# Altium schematic sheet Sheet1.SchDoc
size Letter
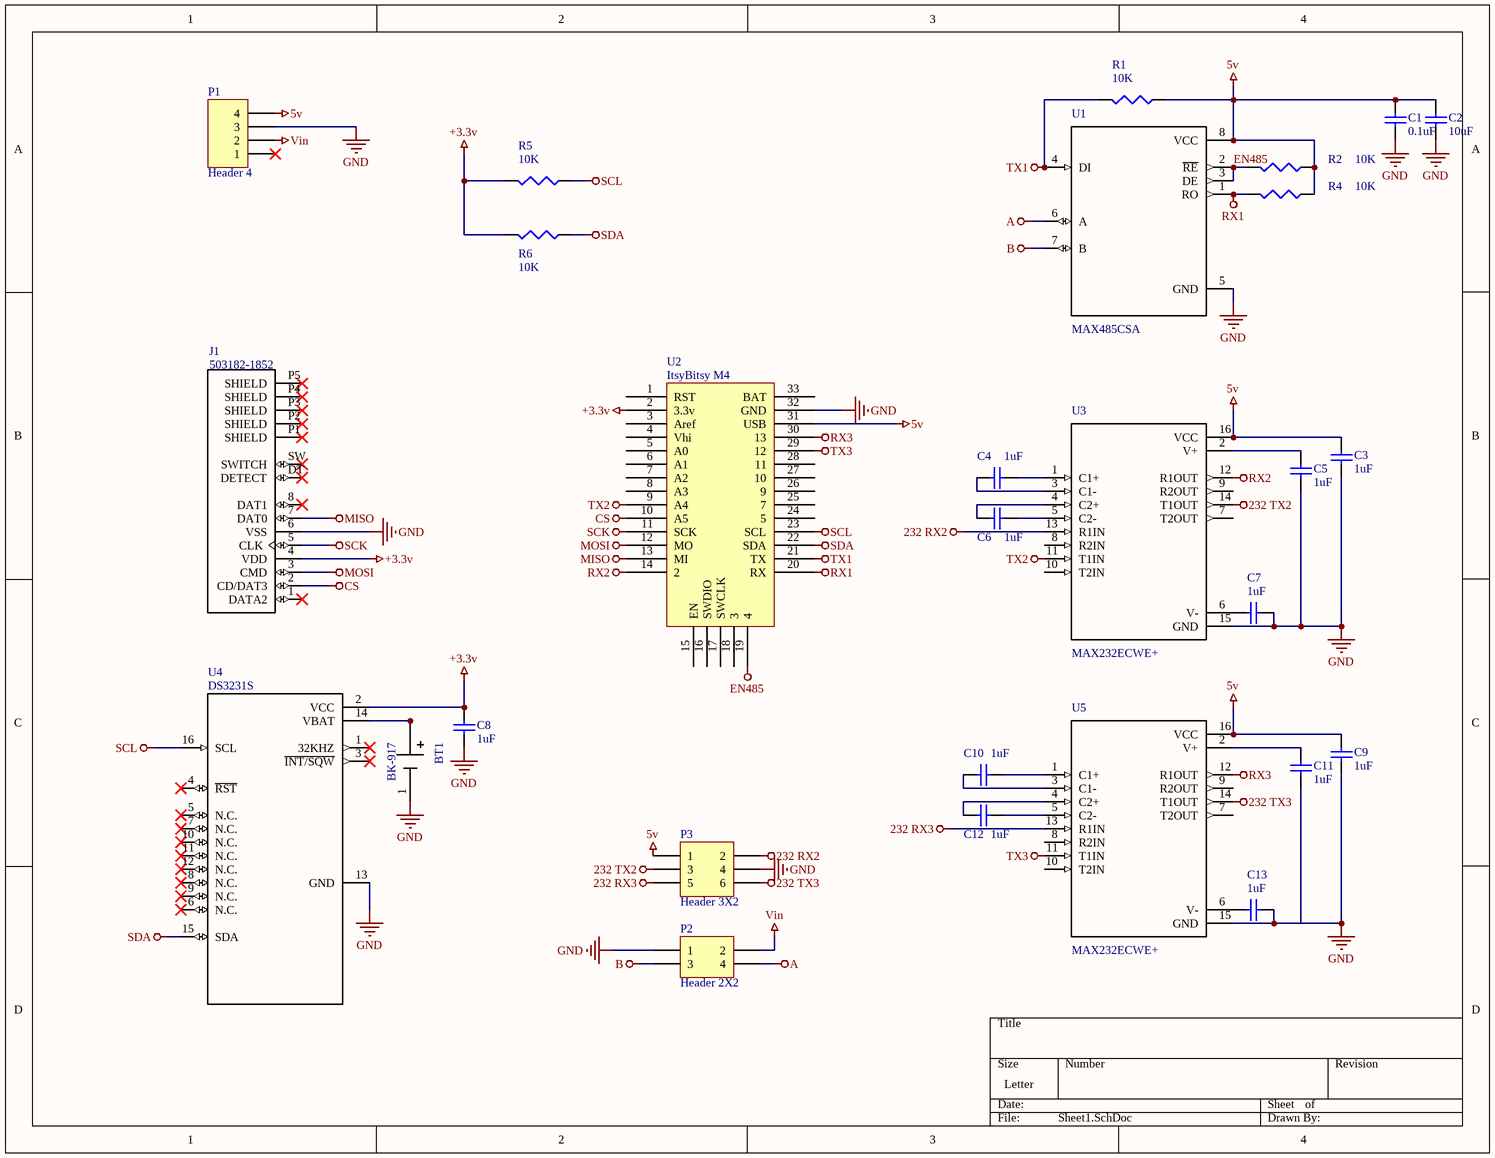
[diagram p0: Sheet1.SchDoc]

## Parts
BT1  BK-917  [*BAT_BK-917_BK-917(Primary)]
C1  value 0.1uF  [1608[0603]]  (hidden comment: Cap Semi)
C2  value 10uF  [1608[0603]]  (hidden comment: Cap Semi)
C3  value 1uF  [1608[0603]]  (hidden comment: Cap Semi)
C4  value 1uF  [1608[0603]]  (hidden comment: Cap Semi)
C5  value 1uF  [1608[0603]]  (hidden comment: Cap Semi)
C6  value 1uF  [1608[0603]]  (hidden comment: Cap Semi)
C7  value 1uF  [1608[0603]]  (hidden comment: Cap Semi)
C8  value 1uF  [1608[0603]]  (hidden comment: Cap Semi)
C9  value 1uF  [1608[0603]]  (hidden comment: Cap Semi)
C10  value 1uF  [1608[0603]]  (hidden comment: Cap Semi)
C11  value 1uF  [1608[0603]]  (hidden comment: Cap Semi)
C12  value 1uF  [1608[0603]]  (hidden comment: Cap Semi)
C13  value 1uF  [1608[0603]]  (hidden comment: Cap Semi)
J1  503182-1852  [*MOLEX_503182-1852_503182-1852(Primary)]
P1  Header 4  [HDR1X4]
P2  Header 2X2  [2x2 MOLEX]
P3  Header 3X2  [2x3 MOLEX]
R1  value 10K  [J1-0603]  (hidden comment: Res3)
R2  value 10K  [J1-0603]  (hidden comment: Res3)
R4  value 10K  [J1-0603]  (hidden comment: Res3)
R5  value 10K  [J1-0603]  (hidden comment: Res3)
R6  value 10K  [J1-0603]  (hidden comment: Res3)
U1  MAX485CSA  [*SOIC127P600X175-8N]
U2  ItsyBitsy M4  [ItsyBitsy M4]
U3  MAX232ECWE+  [*SOIC127P1032X265-16N]
U4  DS3231S  [*SOIC127P1032X265-16N]
U5  MAX232ECWE+  [*SOIC127P1032X265-16N]

## Nets
5v: C1.2 C2.2 C3.2 C9.2 P1.4 P3.1 R1.1 R2.1 R4.1 U1.8(VCC) U2.31(USB) U3.16(VCC) U5.16(VCC)
232 RX2: P3.2 U3.13(R1IN)
232 RX3: P3.5 U5.13(R1IN)
232 TX2: P3.3 U3.14(T1OUT)
232 TX3: P3.6 U5.14(T1OUT)
+3.3v: C8.2 J1.4(VDD) R5.2 R6.2 U2.2(3.3v) U4.2(VCC)
A: P2.4 U1.6(A)
B: P2.3 U1.7(B)
CS: J1.2(CD/DAT3) U2.10(A5)
EN485: R2.2 U1.2(~{RE}) U1.3(DE) U2.19(4)
GND: BT1.1(NEG) C1.1 C2.1 C3.1 C5.1 C7.1 C8.1 C9.1 C11.1 C13.1 J1.6(VSS) P1.3 P2.1 P3.4 U1.5(GND) U2.32(GND) U3.15(GND) U4.13(GND) U5.15(GND)
MISO: J1.7(DAT0) U2.13(MI)
MOSI: J1.3(CMD) U2.12(MO)
RX1: R4.2 U1.1(RO) U2.20(RX)
RX2: U2.14(2) U3.12(R1OUT)
RX3: U2.30(13) U5.12(R1OUT)
SCK: J1.5(CLK) U2.11(SCK)
SCL: R5.1 U2.23(SCL) U4.16(SCL)
SDA: R6.1 U2.22(SDA) U4.15(SDA)
TX1: R1.2 U1.4(DI) U2.21(TX)
TX2: U2.9(A4) U3.11(T1IN)
TX3: U2.29(12) U5.11(T1IN)
Vin: P1.2 P2.2
NetBT1_S1: BT1.S1(POS) BT1.S2(POS) BT1.S3(POS) BT1.S4(POS) U4.14(VBAT)
NetC4_1: C4.1 U3.3(C1-)
NetC4_2: C4.2 U3.1(C1+)
NetC5_2: C5.2 U3.2(V+)
NetC6_1: C6.1 U3.4(C2+)
NetC6_2: C6.2 U3.5(C2-)
NetC7_2: C7.2 U3.6(V-)
NetC10_1: C10.1 U5.3(C1-)
NetC10_2: C10.2 U5.1(C1+)
NetC11_2: C11.2 U5.2(V+)
NetC12_1: C12.1 U5.4(C2+)
NetC12_2: C12.2 U5.5(C2-)
NetC13_2: C13.2 U5.6(V-)

Not connected (* = marked no-connect by the designer): J1 1(DATA2)* 8(DAT1)* DT(DETECT)* P1(SHIELD)* P2(SHIELD)* P3(SHIELD)* P4(SHIELD)* P5(SHIELD)* SW(SWITCH)*; P1 1*; U2 1(RST) 3(Aref) 4(Vhi) 5(A0) 6(A1) 7(A2) 8(A3) 15(EN) 16(SWDIO) 17(SWCLK) 18(3) 24(5) 25(7) 26(9) 27(10) 28(11) 33(BAT); U3 7(T2OUT) 8(R2IN) 9(R2OUT) 10(T2IN); U4 1(32KHZ)* 3(~{INT/SQW})* 4(~{RST})* 5(N.C.)* 6(N.C.)* 7(N.C.)* 8(N.C.)* 9(N.C.)* 10(N.C.)* 11(N.C.)* 12(N.C.)*; U5 7(T2OUT) 8(R2IN) 9(R2OUT) 10(T2IN)

## Library data of the parts
BT1 = BK-917: BATTERY RETAINER COIN PC PIN; MF: MPD; Package: None; MP: BK-917; SnapEDA_Link: https://www.snapeda.com/parts/BK-917/Memory%20Protection%20Devices/view-part/4219668/?ref=snap; Availability: Unavailable; Price: None; Value: *
C1-C13 = Cap Semi: Capacitor (Semiconductor SIM Model); Published: 8-Jun-2000; LatestRevisionDate: 29-May-2009; LatestRevisionNote: IPC-7351 Footprint Added.; PackageReference: C1206; Publisher: Altium Limited; PackageDescription: Chip Capacitor
J1 = 503182-1852: MICRO SD NORMAL ULTRALOWPRO8CKTE; MP: 5031821852; MF: Molex; Availability: Unavailable; Package: None; SnapEDA_Link: https://www.snapeda.com/parts/5031821852/Molex/view-part/?ref=snap; Price: None; Value: *
P1 = Header 4: Header, 4-Pin; LatestRevisionDate: 17-Jul-2002; LatestRevisionNote: Re-released for DXP Platform.; Publisher: Altium Limited
P2 = Header 2X2: Header, 2-Pin, Dual row; LatestRevisionDate: 17-Jul-2002; LatestRevisionNote: Re-released for DXP Platform.; Publisher: Altium Limited
P3 = Header 3X2: Header, 3-Pin, Dual row; LatestRevisionDate: 17-Jul-2002; LatestRevisionNote: Re-released for DXP Platform.; Publisher: Altium Limited
R1 R2 R4-R6 = Res3: Resistor; Published: 8-Jun-2000; LatestRevisionDate: 29-May-2009; LatestRevisionNote: IPC-7351 Footprint Added.; PackageReference: J1-0603; Publisher: Altium Limited; PackageDescription: Chip Resistor
U1 = MAX485CSA: 1/1 Transceiver Half RS422, RS485 8-SOIC; MF: Maxim Integrated; MP: MAX485CSA; Package: SOIC-8 Maxim Integrated; Availability: Unavailable; Price: None; SnapEDA_Link: https://www.snapeda.com/parts/MAX485CSA/Maxim%20Integrated/view-part/1413252/?ref=snap; Value: *
U3 U5 = MAX232ECWE+: Dual Transmitter/Receiver RS-232 16-Pin SOIC W; MF: Maxim Integrated; SnapEDA_Link: https://www.snapeda.com/parts/MAX232ECWE%2B/Maxim%20Integrated/view-part/?ref=snap; Availability: Unavailable; MP: MAX232ECWE+; Price: None; Package: SOIC-16 Maxim; Value: *
U4 = DS3231S: Real Time Clock Serial 16-Pin SOIC; MF: Maxim Integrated; Price: None; Package: SOIC-16 Maxim Integrated; SnapEDA_Link: https://www.snapeda.com/parts/DS3231S/Maxim%20Integrated/view-part/?ref=snap; Availability: Unavailable; MP: DS3231S; Value: *